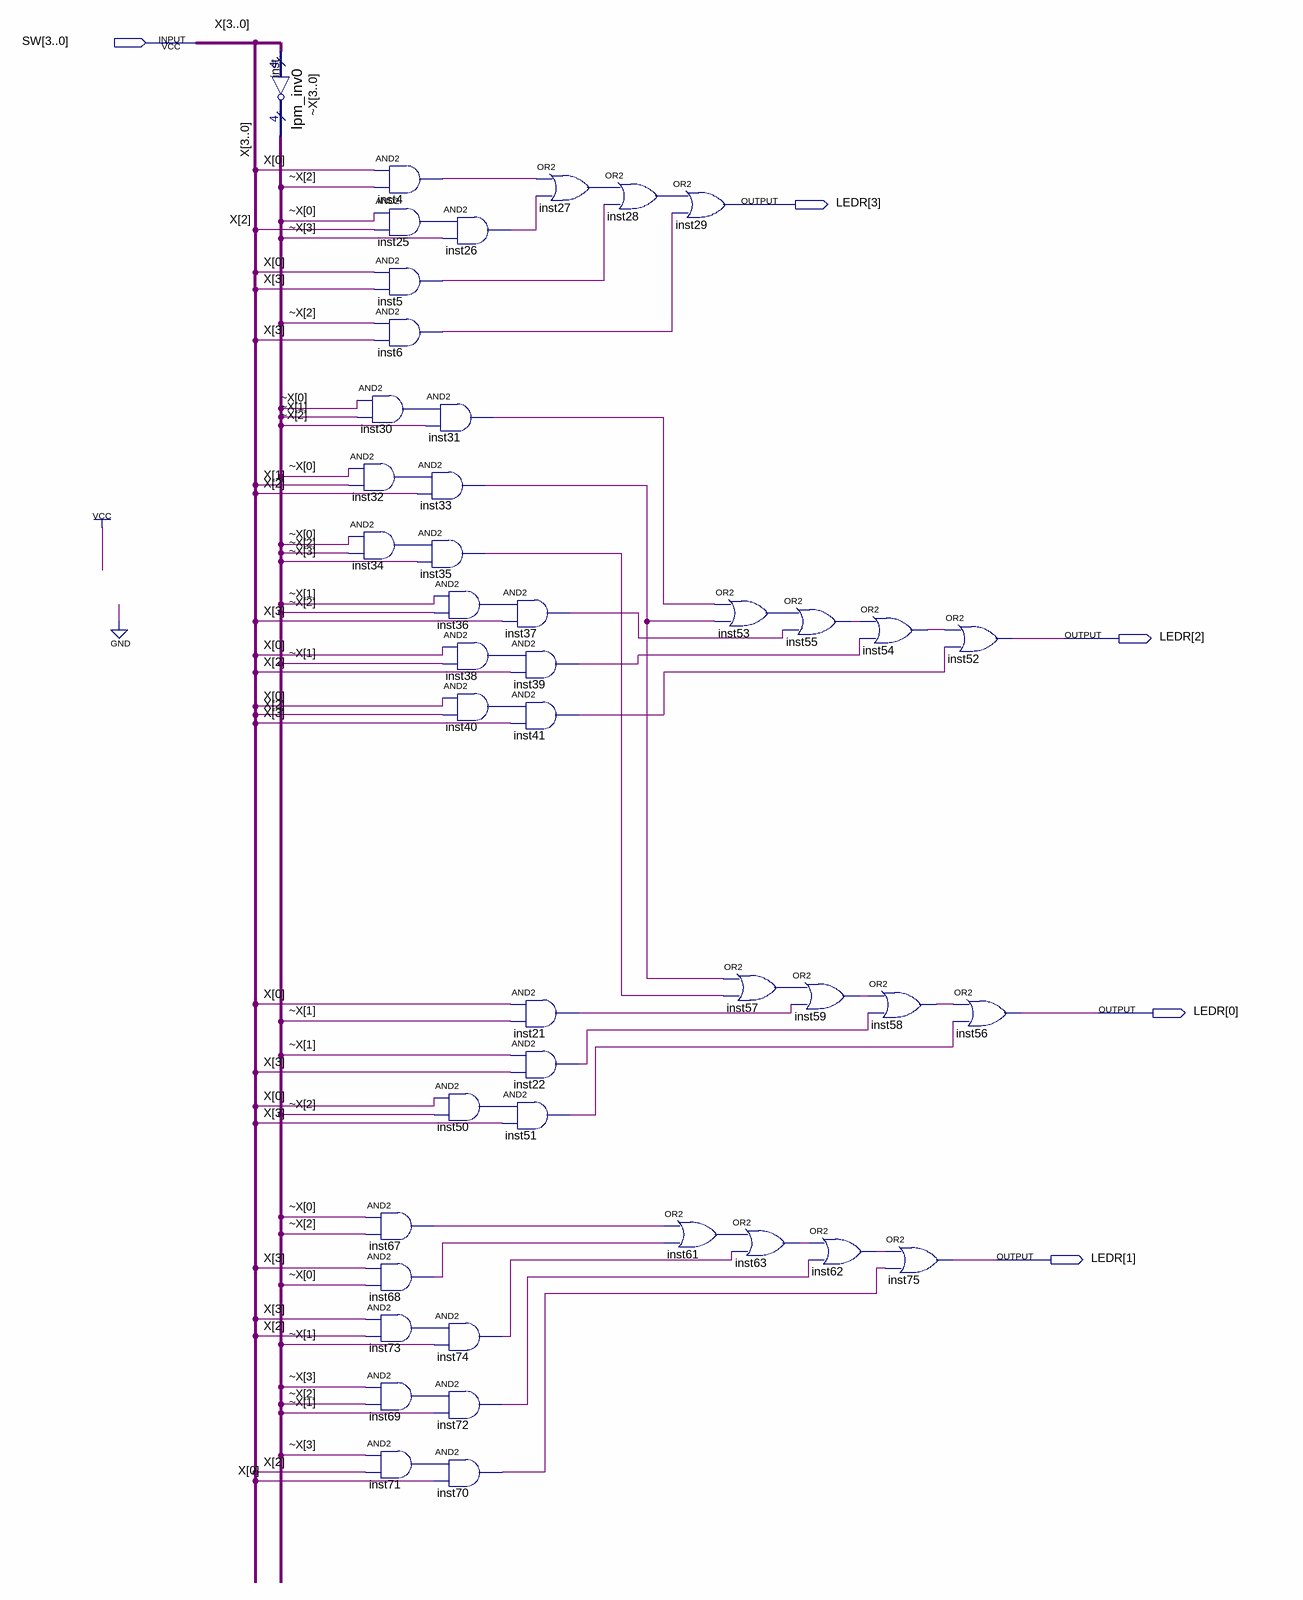
[diagram p0: schematic sheet]
// Quartus schematic Lab2.bdf as structural Verilog: 45 symbols, 5 pins
module Lab2 (
  input  [3:0] SW,
  output [3:0] LEDR
);

  wire inst4_out, inst5_out, inst6_out, inst21_out, inst22_out, inst25_out, inst26_out, inst27_out,
       inst28_out, inst30_out, inst31_out, inst32_out, inst33_out, inst34_out, inst35_out, inst36_out,
       inst37_out, inst38_out, inst39_out, inst40_out, inst41_out, inst50_out, inst51_out, inst53_out,
       inst54_out, inst55_out, inst57_out, inst58_out, inst59_out, inst61_out, inst62_out, inst63_out,
       inst67_out, inst68_out, inst69_out, inst70_out, inst71_out, inst72_out, inst73_out, inst74_out;
  wire [3:0] \~X ;

  lpm_inv0 inst (.data(SW), .result(\~X ));
  and inst4 (inst4_out, SW[0], \~X [2]);
  and inst25 (inst25_out, \~X [0], SW[2]);
  and inst5 (inst5_out, SW[0], SW[3]);
  and inst6 (inst6_out, \~X [2], SW[3]);
  and inst30 (inst30_out, \~X [0], \~X [1]);
  and inst32 (inst32_out, \~X [0], SW[1]);
  and inst34 (inst34_out, \~X [0], \~X [2]);
  and inst67 (inst67_out, \~X [0], \~X [2]);
  and inst68 (inst68_out, SW[3], \~X [0]);
  and inst73 (inst73_out, SW[3], SW[2]);
  and inst69 (inst69_out, \~X [3], \~X [2]);
  and inst71 (inst71_out, \~X [3], SW[2]);
  and inst26 (inst26_out, inst25_out, \~X [3]);
  and inst31 (inst31_out, inst30_out, \~X [2]);
  and inst33 (inst33_out, inst32_out, SW[2]);
  and inst35 (inst35_out, inst34_out, \~X [3]);
  and inst36 (inst36_out, \~X [1], \~X [2]);
  and inst38 (inst38_out, SW[0], \~X [1]);
  and inst40 (inst40_out, SW[0], SW[2]);
  and inst50 (inst50_out, SW[0], \~X [2]);
  and inst74 (inst74_out, inst73_out, \~X [1]);
  and inst72 (inst72_out, inst69_out, \~X [1]);
  and inst70 (inst70_out, inst71_out, SW[0]);
  or inst27 (inst27_out, inst4_out, inst26_out);
  and inst37 (inst37_out, inst36_out, SW[3]);
  and inst39 (inst39_out, inst38_out, SW[2]);
  and inst41 (inst41_out, inst40_out, SW[3]);
  and inst21 (inst21_out, SW[0], \~X [1]);
  and inst22 (inst22_out, \~X [1], SW[3]);
  and inst51 (inst51_out, inst50_out, SW[3]);
  or inst28 (inst28_out, inst27_out, inst5_out);
  or inst29 (LEDR[3], inst28_out, inst6_out);
  or inst61 (inst61_out, inst67_out, inst68_out);
  or inst53 (inst53_out, inst31_out, inst33_out);
  or inst57 (inst57_out, inst33_out, inst35_out);
  or inst63 (inst63_out, inst61_out, inst74_out);
  or inst55 (inst55_out, inst53_out, inst37_out);
  or inst59 (inst59_out, inst57_out, inst21_out);
  or inst62 (inst62_out, inst63_out, inst72_out);
  or inst54 (inst54_out, inst55_out, inst39_out);
  or inst58 (inst58_out, inst59_out, inst22_out);
  or inst52 (LEDR[2], inst54_out, inst41_out);
  or inst75 (LEDR[1], inst62_out, inst70_out);
  or inst56 (LEDR[0], inst58_out, inst51_out);

  // Other names for the same wires on the sheet: X[3:0] = SW
endmodule
